# EasyEDA Pro project ProPrj_桌面数控电源New_2025-02-12.epro, board PCB1
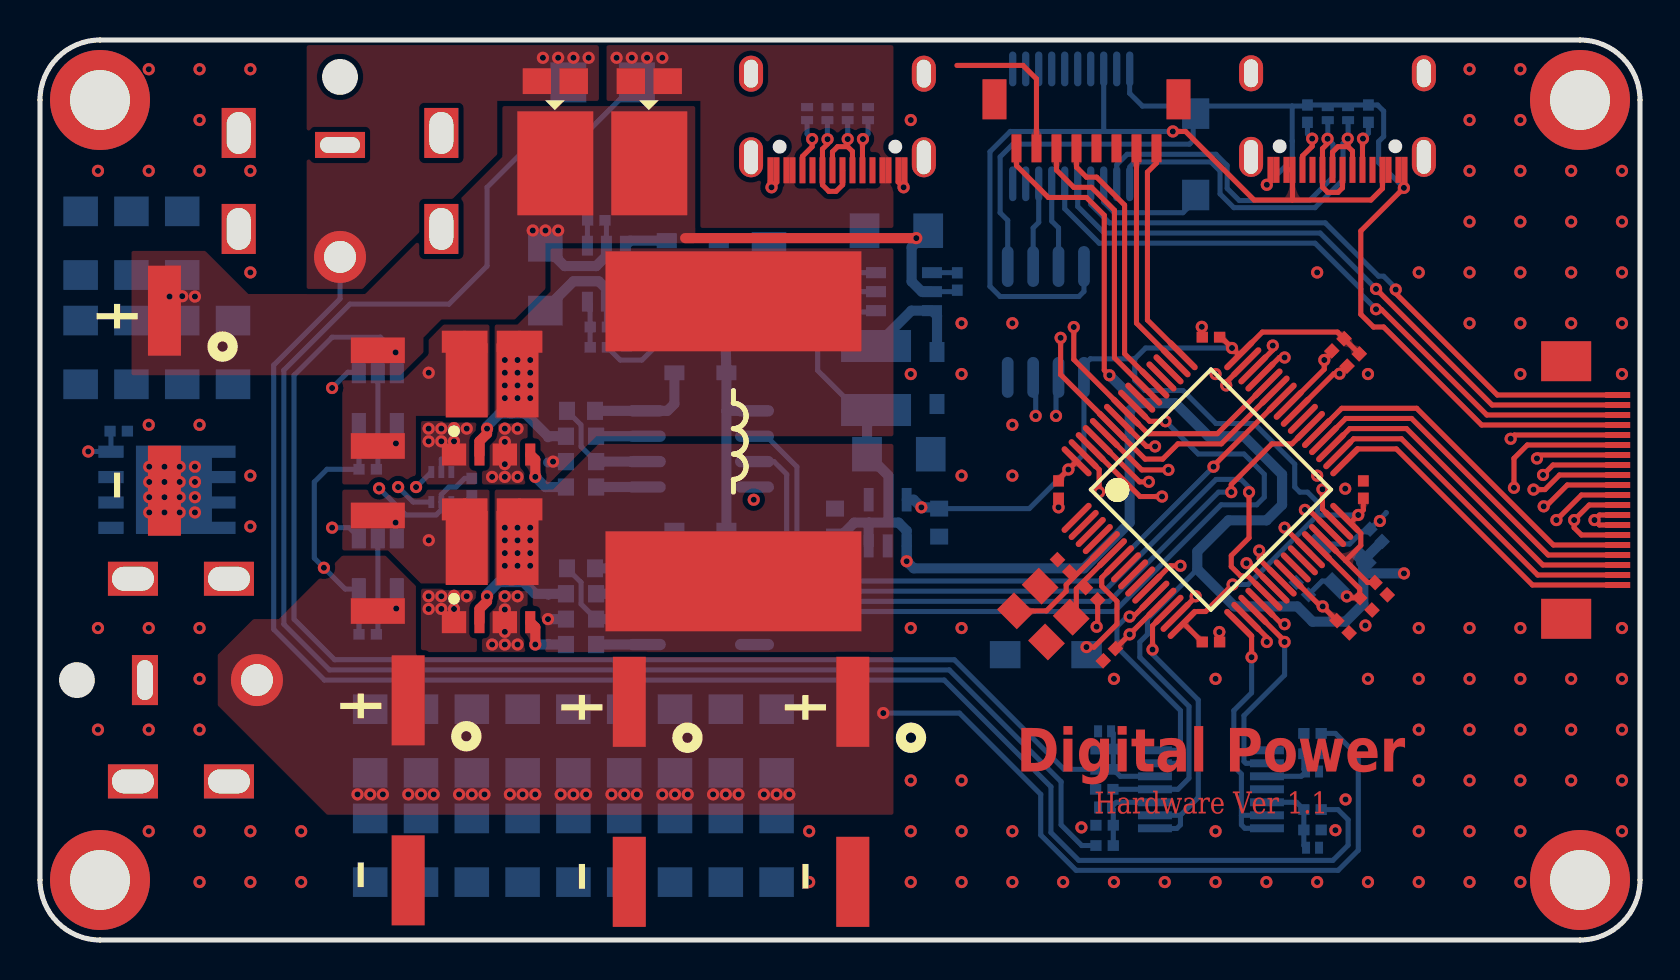
[diagram p2: board, top side]
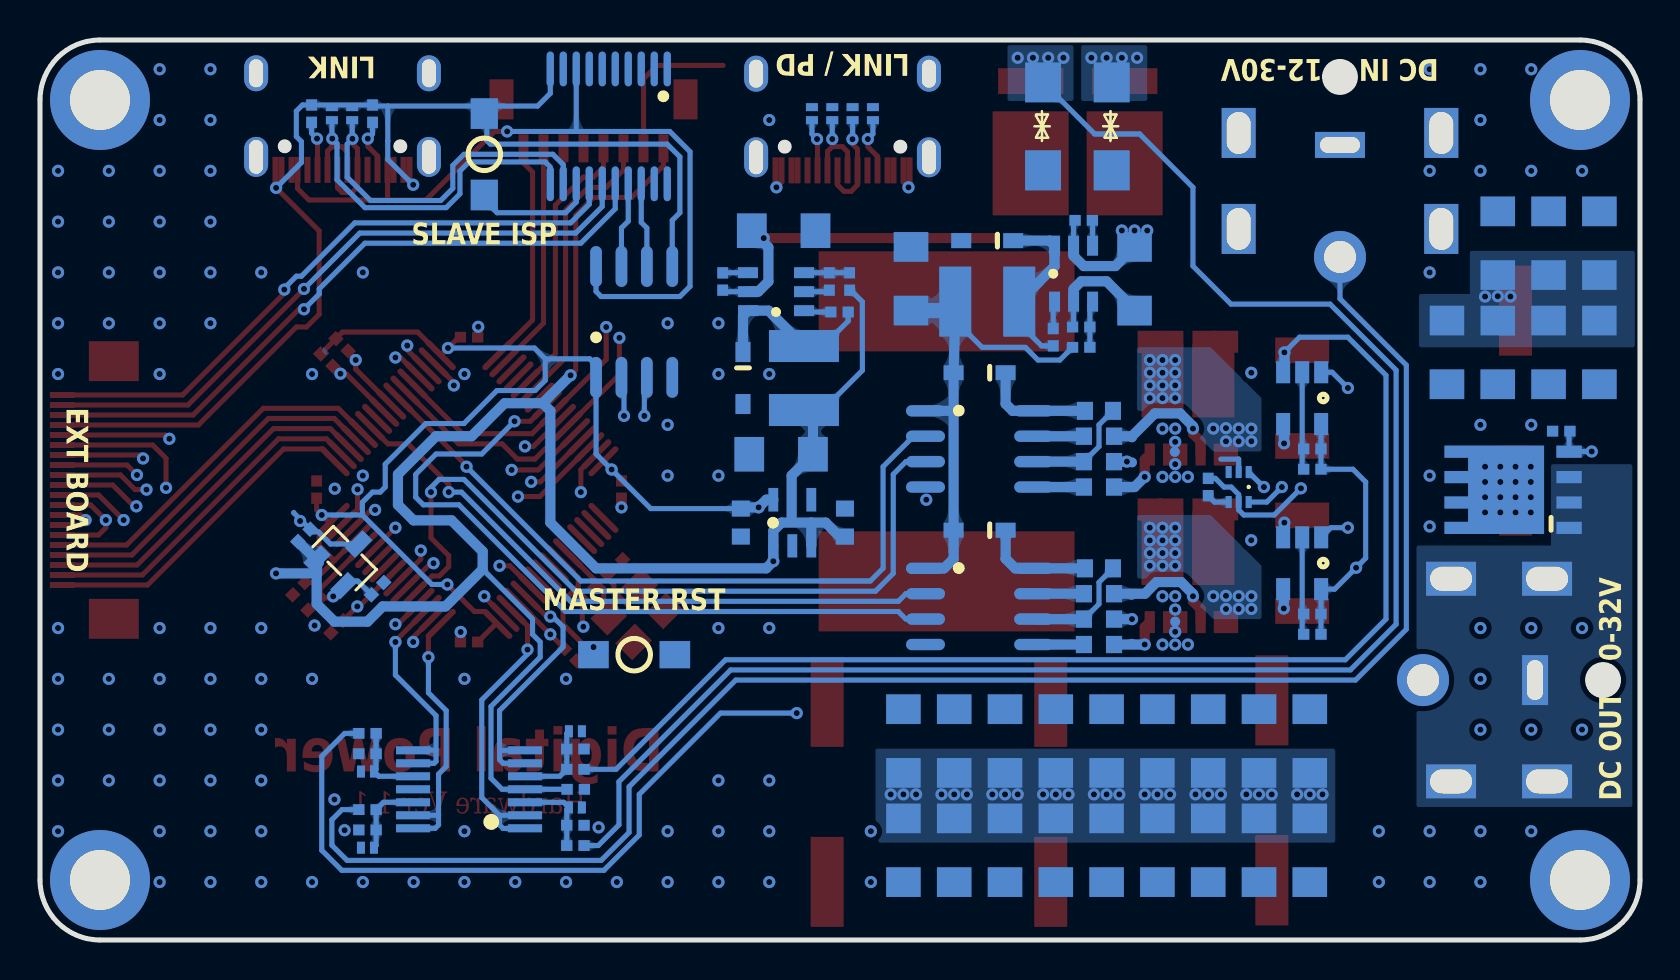
[diagram p3: board, bottom side, seen from below]

Outline 80 x 45 mm; copper layers: Top Layer, Inner1, Inner2, Bottom Layer. Coordinates in mm from the lower left corner of the outline.
Outline path: 0,42 0,3 arc(0.88,0.88) 3,0 77,0 arc(79.12,0.88) 80,3 80,42 arc(79.12,44.12) 77,45 3,45 arc(0.88,44.12) 0,42
Stack: Top Layer 0.035mm 外层铜厚1oz / Dielectric1 0.2104mm 7628 RC49% 8.6mil / Inner1 0.0152mm 内层铜厚 / Dielectric2 1.065mm 1.1mm H/HOZ Copper / Inner2 0.0152mm 内层铜厚 / Dielectric3 0.2104mm 7628 RC49% 8.6mil / Bottom Layer 0.035mm 外层铜厚1oz

## Design rules (mm)
template: 自定义配置
spacing copperThickness1oz (default): track to track 0.102, other pairs 0.152 to 0.3
spacing copperThickness2oz: track to track 0.203, other pairs 0.152 to 0.3
track width copperThickness1oz (default): min 0.127, default 0.254, max 2.54
track width copperThickness2oz: min 0.203, default 0.254, max 2.54
differential pair differentialPair (default): width min 0.127, default 0.254, max 2.54; gap min 0.152, default 0.152
via viaSize (default): diameter min 0.5, default 0.61, max 10; hole min 0.3, default 0.305, max 6.3
net VOUT uses Power
net VIN uses Power
net P_PD_IN uses Power
net P_DC_IN uses Power
net $1N8063 uses Power
net $1N8062 uses Power
net $1N8076 uses Power
net $1N8059 uses Power
net $1N11837 uses Power
pour e730 uses Power
pour e764 uses Power

## Placement (name value [footprint] x y rotation side)
C14  1uF  [C0603]  27.05 26.46 180 bottom
C15  1uF  [C0603]  27.05 18.58 180 bottom
C28  22uF  [C0603]  39.75 20.87 270 bottom
C29  22uF  [C0603]  44.96 20.87 90 bottom
C33  330uF  [CAP-SMD_BD10.0-L10.3-W10.3-FD]  18.41 7.48 270 top
C34  330uF  [CAP-SMD_BD10.0-L10.3-W10.3-FD]  29.46 7.41 270 top
C37  330uF  [CAP-SMD_BD10.0-L10.3-W10.3-FD]  6.22 26.97 270 top
C38  330uF  [CAP-SMD_BD10.0-L10.3-W10.3-FD]  40.64 7.41 270 top
C43  15pF  [C0402]  52.58 17.31 135 top
C44  15pF  [C0402]  51.18 18.71 315 top
C55  10uF  [C1206]  2.03 29.38 90 bottom
C56  10uF  [C1206]  4.57 29.38 90 bottom
C57  10uF  [C1206]  7.11 29.38 90 bottom
C58  10uF  [C1206]  9.65 29.38 90 bottom
C59  10uF  [C1206]  2.03 34.84 270 bottom
C60  10uF  [C1206]  7.11 34.84 270 bottom
C61  10uF  [C1206]  4.57 34.84 270 bottom
C66  10uF  [C1206]  16.51 4.49 90 bottom
C67  10uF  [C1206]  19.05 4.49 90 bottom
C68  10uF  [C1206]  21.59 4.49 90 bottom
C69  10uF  [C1206]  24.13 4.49 90 bottom
C70  10uF  [C1206]  26.67 4.49 90 bottom
C71  10uF  [C1206]  29.21 4.49 90 bottom
C72  10uF  [C1206]  31.75 9.95 270 bottom
C73  10uF  [C1206]  29.21 9.95 270 bottom
C74  10uF  [C1206]  26.67 9.95 270 bottom
C75  10uF  [C1206]  24.13 9.95 270 bottom
C76  10uF  [C1206]  21.59 9.95 270 bottom
C77  10uF  [C1206]  19.05 9.95 270 bottom
C78  10uF  [C1206]  16.51 9.95 270 bottom
C79  100nF  [C0402]  29.34 30.14 90 bottom
C80  10uF  [C1206]  36.45 33.06 270 bottom
C81  10uF  [C1206]  25.27 33.06 90 bottom
C82  100nF  [C0402]  40.02 31.4 0 bottom
C83  10uF  [C1206]  42.95 24.29 180 bottom
C84  10uF  [C1206]  42.82 35.46 0 bottom
C85  100nF  [C0402]  16.38 16.3 180 bottom
C86  1uF  [C0402]  16.38 15.28 180 bottom
C87  100nF  [C0402]  16.38 24.55 180 bottom
C88  1uF  [C0402]  16.38 23.54 180 bottom
C89  100nF  [C0402]  21.59 22.65 90 bottom
C90  100nF  [C0402]  58.55 30.14 0 top
C91  100nF  [C0402]  67.06 17.57 135 top
C92  100nF  [C0402]  58.55 14.9 180 top
C93  100nF  [C0402]  66.17 22.52 270 top
C94  100nF  [C0402]  66.8 20.23 135 bottom
C95  100nF  [C0402]  63.12 17.57 135 bottom
C96  100nF  [C0402]  50.93 22.52 270 top
C97  100nF  [C0402]  66.29 16.81 315 top
C98  10uF  [C1206]  31.75 4.49 90 bottom
C99  10uF  [C1206]  36.83 9.95 270 bottom
C100  10uF  [C1206]  36.83 4.49 90 bottom
C101  10uF  [C1206]  34.29 9.95 270 bottom
C102  10uF  [C1206]  34.29 4.49 90 bottom
C103  100nF  [C0402]  53.21 7.53 180 bottom
D5  1N5819WS  [SOD-323_L1.6-W1.3-LS2.6-RD-1]  33.02 28.36 0 bottom
D6  1N5819WS  [SOD-323_L1.6-W1.3-LS2.6-RD-1]  33.02 20.49 0 bottom
D21  PESD5V0G1BLYL  [DFN1006-2L-BI-1]  38.35 41.32 270 bottom
D22  PESD5V0G1BLYL  [DFN1006-2L-BI-1]  41.4 41.32 270 bottom
D23  PESD5V0G1BLYL  [DFN1006-2L-BI-1]  39.37 41.32 270 bottom
D24  PESD5V0G1BLYL  [DFN1006-2L-BI-1]  40.39 41.32 270 bottom
D25  SB10100  [TO-277_3P-L5.4-W4.0-LS6.5-TR]  25.76 40.89 90 top
D26  SB10100  [TO-277_3P-L5.4-W4.0-LS6.5-TR]  30.46 40.89 90 top
D27  PESD5V0G1BLYL  [DFN1006-2L-BI-1]  65.41 41.32 270 bottom
D28  PESD5V0G1BLYL  [DFN1006-2L-BI-1]  64.39 41.32 270 bottom
D31  1N5819WS  [SOD-323_L1.6-W1.3-LS2.6-RD-1]  32.64 34.97 0 bottom
D32  1N5819WS  [SOD-323_L1.6-W1.3-LS2.6-RD-1]  44.85 28.1 270 bottom
D33  SMAJ36CA  [SMA_L4.4-W2.8-LS5.1-BI]  26.42 40.68 270 bottom
D34  SMAJ36CA  [SMA_L4.4-W2.8-LS5.1-BI]  29.84 40.68 270 bottom
D35  PESD5V0G1BLYL  [DFN1006-2L-BI-1]  53.23 10.44 0 bottom
D36  PESD5V0G1BLYL  [DFN1006-2L-BI-1]  63.63 8.42 180 bottom
D37  PESD5V0G1BLYL  [DFN1006-2L-BI-1]  53.23 6.63 0 bottom
D38  PESD5V0G1BLYL  [DFN1006-2L-BI-1]  63.63 4.61 180 bottom
DC1  KH-DC-007B-2.5G  [DC-IN-TH_KH-DC-007B-2.1G]  15 37.25 0 top
DC2  KH-DC-007B-2.5G  [DC-IN-TH_KH-DC-007B-2.1G]  7.75 13 90 top
FPC1  FPC-05F-20PH20  [FPC-SMD_20P-P0.50_XUNPU_FPC-05F-20PH20]  77.6 22.5 270 top
L1  22uH  [IND-SMD_L18.3-W17.0]  34.67 24.93 270 top
L2  6.8uH  [IND-SMD_L4.0-W4.0]  32.64 31.92 0 bottom
L3  6.8uH  [IND-SMD_L4.0-W4.0]  41.8 28.1 270 bottom
LDO1  ME6211C33M5G-N  [SOT-23-5_L3.0-W1.7-P0.95-LS2.8-BL]  42.38 20.86 180 bottom
NOREF  -  [Pad_e127]  3 42 0 top
NOREF#2  -  [Pad_e128]  3 3 0 top
NOREF#3  -  [Pad_e130]  77 3 0 top
NOREF#4  -  [Pad_e129]  77 42 0 top
Q2  FDMS86101A  [POWER56_L5.0-W6.0-P1.27-LS6.6-BL]  6.35 22.52 90 bottom
R17  20  [R0603]  27.05 25.19 180 bottom
R18  20  [R0603]  27.05 22.65 180 bottom
R19  20  [R0603]  27.05 17.31 0 bottom
R20  20  [R0603]  27.05 14.77 0 bottom
R21  5  [R0603]  27.05 16.04 0 bottom
R22  5  [R0603]  27.05 23.92 180 bottom
R54  10K  [R0402]  53.23 8.53 180 bottom
R55  10K  [R0402]  63.63 10.33 0 bottom
R56  10K  [R0402]  53.23 4.72 180 bottom
R57  10K  [R0402]  63.63 6.52 0 bottom
R65  1K  [R0402]  53.23 9.55 0 bottom
R66  1K  [R0402]  63.63 9.31 180 bottom
R67  1K  [R0402]  53.23 5.74 0 bottom
R68  1K  [R0402]  63.63 5.5 180 bottom
R71  10mR  [R2010]  16.89 27.09 270 top
R72  10mR  [R2010]  16.89 18.84 270 top
R73  10K  [R0402]  63.37 41.32 270 bottom
R74  10K  [R0402]  66.42 41.32 270 bottom
R75  14K  [R0402]  27.94 29.63 0 bottom
R76  1K  [R0402]  27.94 30.65 180 bottom
R77  10K  [R0402]  27.81 35.98 0 bottom
R78  5.1K  [R0402]  39.52 32.92 270 bottom
R79  1K  [R0402]  40.53 32.92 90 bottom
R80  10K  [R0402]  45.87 32.92 270 bottom
R81  ???  [R0402]  53.47 14.27 45 top
R82  ???  [R0402]  65.15 15.66 135 top
R83  1K  [R0402]  64.9 29.76 45 top
R84  1K  [R0402]  65.66 29 45 top
R85  1M  [R0402]  3.94 25.44 180 bottom
SW5  -  [Key_SMD_3x4x2]  50.29 14.27 180 bottom
SW6  -  [Key_SMD_3x4x2]  57.78 39.28 90 bottom
TP7  -  [Test-Point-0.5mm]  25.42 14.81 180 bottom
TP8  -  [Test-Point-0.5mm]  25.42 17.26 180 bottom
TP9  -  [Test-Point-0.5mm]  25.4 25.13 180 bottom
TP10  -  [Test-Point-0.5mm]  25.4 22.65 180 bottom
TP11  -  [Test-Point-0.5mm]  19.43 28.36 180 bottom
TP12  -  [Test-Point-0.5mm]  23.24 15.92 180 bottom
TP13  -  [Test-Point-0.5mm]  25.4 23.88 180 bottom
TP14  -  [Test-Point-0.5mm]  25.42 16 180 bottom
TP15  -  [Test-Point-0.5mm]  23.26 24.41 180 bottom
TP16  -  [Test-Point-0.5mm]  19.45 19.99 180 bottom
U1  STM32G431RBT6  [LQFP-64_L10.0-W10.0-P0.50-LS12.0-BL]  58.55 22.52 315 top
U9  IRS21867STRPBF  [SOIC-8_L5.0-W4.0-P1.27-LS6.0-BL]  33.02 24.55 270 bottom
U10  IRS21867STRPBF  [SOIC-8_L5.0-W4.0-P1.27-LS6.0-BL]  33.02 16.68 270 bottom
U48  AP50H06NF  [DFN-8_L6.0-W5.0-P1.27-LS6.2-BL_STL50DN6F7]  22.61 27.09 0 top
U49  AP50H06NF  [DFN-8_L6.0-W5.0-P1.27-LS6.2-BL_STL50DN6F7]  22.61 18.71 0 top
U50  WAFER-SH1.0-8PLB  [CONN-SMD_8P-P1.00_XUNPU_WAFER-SH1.0-8PLB]  52.32 40.81 180 top
U52  π122U31  [SOIC-8_L4.9-W3.9-P1.27-LS6.0-BL]  50.29 30.9 180 bottom
U53  STC8H8K64U-45I-TSSOP20  [TSSOP-20_L6.5-W4.4-P0.65-LS6.5-BL]  51.56 40.68 0 bottom
U56  INA139NA/250  [TSOT-23-5_L2.9-W1.6-P0.95-LS2.8-BR]  16.89 27.09 90 bottom
U57  INA139NA/250  [TSOT-23-5_L2.9-W1.6-P0.95-LS2.8-BR]  16.89 18.84 90 bottom
U58  -  [SOT-23-6_L2.9-W1.6-P0.95-LS2.8-BR]  28.32 33.32 270 bottom
U59  -  [SOT-23-6_L2.9-W1.6-P0.95-LS2.8-BR]  43.2 32.42 180 bottom
U60  TMP102AIDRLR  [SOT-563_L1.6-W1.2-P0.50-LS1.6-BR]  20.07 22.65 90 bottom
U61  REF3033AIDBZRQ1  [SOT-23-3_L2.9-W1.3-P1.90-LS2.4-BR]  64.77 19.09 315 bottom
U62  LMV324IPWR  [TSSOP-14_L5.0-W4.4-P0.65-LS6.4-BL]  58.55 7.53 90 bottom
USB5  -  [USB_TYPE-C-16P]  65 40.92 180 top
USB6  -  [USB_TYPE-C-16P]  40 40.9 180 top
X1  24MHz  [OSC-SMD_4P-L3.2-W2.5-BL]  50.16 16.3 135 top

## Footprints (pads in the part's own frame, mm; a bottom-side part is the same pattern mirrored in y, then rotated)
C0402
  rect 0.566x0.54 smd: 1(-0.433,0) 2(0.433,0)
C0603
  rect 0.8x0.9 smd: 1(-0.7,0) 2(0.7,0)
C1206
  rect 1.485x1.728 smd: 1(-1.593,0) 2(1.593,0)
CAP-SMD_BD10.0-L10.3-W10.3-FD
  rect 4.5x1.65 smd: 1(-4.5,0) 2(4.5,0)
CONN-SMD_8P-P1.00_XUNPU_WAFER-SH1.0-8PLB
  rect 0.5x1.4 smd: 1(-3.5,1.225) 2(-2.5,1.225) 3(-1.5,1.225) 4(-0.5,1.225) 5(0.5,1.225) 6(1.5,1.225) 7(2.5,1.225) 8(3.5,1.225)
  rect 1.2x2 smd: 9(4.6,-1.225) 10(-4.6,-1.225)
DC-IN-TH_KH-DC-007B-2.1G
  rect 1.7x2.5 hole 1.2x2.1: 2(-5.065,3.1) 2(-5.065,-1.7) 2(5.065,3.1) 2(5.065,-1.7)
  rect 2.5x1.3 hole 2x0.8: 3(0,2.5)
  round 2.6 hole 1.6: 4(0,-3.1)
DFN1006-2L-BI-1
  rect 0.4x0.6 smd: 1(-0.325,0) 2(0.325,0)
DFN-8_L6.0-W5.0-P1.27-LS6.2-BL_STL50DN6F7
  rect 1.219x1.1 smd: 1(-1.905,-2.82) 3(0.635,-2.82) 5(1.905,2.82) 6(0.838,2.82) 7(-0.838,2.82) 8(-1.905,2.82)
  rect 0.508x1.1 smd: 2(-0.635,-2.82) 4(1.905,-2.82)
  rect 2.1x3.7 smd: 6(1.27,0.889) 8(-1.27,0.889)
FPC-SMD_20P-P0.50_XUNPU_FPC-05F-20PH20
  rect 0.3x1.25 smd: 1(-4.75,1.288) 2(-4.25,1.288) 3(-3.75,1.288) 4(-3.25,1.288) 5(-2.75,1.288) 6(-2.25,1.288) 7(-1.75,1.288) 8(-1.25,1.288) 9(-0.75,1.288) 10(-0.25,1.288) 11(0.25,1.288) 12(0.75,1.288) 13(1.25,1.288) 14(1.75,1.288) 15(2.25,1.288) 16(2.75,1.288) 17(3.25,1.288) 18(3.75,1.288) 19(4.25,1.288) 20(4.75,1.288)
  rect 2x2.5 smd: 21(6.44,-1.288) 22(-6.44,-1.288)
IND-SMD_L4.0-W4.0
  rect 1.6x3.5 smd: 1(-1.6,0) 2(1.6,0)
IND-SMD_L18.3-W17.0
  rect 5x12.8 smd: 1(-7,0) 2(7,0)
Key_SMD_3x4x2
  rect 1.53x1.36 smd: 1(-2.035,0) 2(2.035,0)
LQFP-64_L10.0-W10.0-P0.50-LS12.0-BL
  oval 0.3x2 smd: 1(-3.75,-5.75) 2(-3.25,-5.75) 3(-2.75,-5.75) 4(-2.25,-5.75) 5(-1.75,-5.75) 6(-1.25,-5.75) 7(-0.75,-5.75) 8(-0.25,-5.75) 9(0.25,-5.75) 10(0.75,-5.75) 11(1.25,-5.75) 12(1.75,-5.75) 13(2.25,-5.75) 14(2.75,-5.75) 15(3.25,-5.75) 16(3.75,-5.75) 33(3.75,5.75) 34(3.25,5.75) 35(2.75,5.75) 36(2.25,5.75) 37(1.75,5.75) 38(1.25,5.75) 39(0.75,5.75) 40(0.25,5.75) 41(-0.25,5.75) 42(-0.75,5.75) 43(-1.25,5.75) 44(-1.75,5.75) 45(-2.25,5.75) 46(-2.75,5.75) 47(-3.25,5.75) 48(-3.75,5.75)
  oval 2x0.3 smd: 17(5.75,-3.75) 18(5.75,-3.25) 19(5.75,-2.75) 20(5.75,-2.25) 21(5.75,-1.75) 22(5.75,-1.25) 23(5.75,-0.75) 24(5.75,-0.25) 25(5.75,0.25) 26(5.75,0.75) 27(5.75,1.25) 28(5.75,1.75) 29(5.75,2.25) 30(5.75,2.75) 31(5.75,3.25) 32(5.75,3.75) 49(-5.75,3.75) 50(-5.75,3.25) 51(-5.75,2.75) 52(-5.75,2.25) 53(-5.75,1.75) 54(-5.75,1.25) 55(-5.75,0.75) 56(-5.75,0.25) 57(-5.75,-0.25) 58(-5.75,-0.75) 59(-5.75,-1.25) 60(-5.75,-1.75) 61(-5.75,-2.25) 62(-5.75,-2.75) 63(-5.75,-3.25) 64(-5.75,-3.75)
OSC-SMD_4P-L3.2-W2.5-BL
  rect 1.4x1.2 smd: 1(-1.1,-0.875) 2(1.1,-0.875) 3(1.1,0.875) 4(-1.1,0.875)
Pad_e127
  round 5 hole 3: 1(0,0)
Pad_e128
  round 5 hole 3: 1(0,0)
Pad_e129
  round 5 hole 3: 1(0,0)
Pad_e130
  round 5 hole 3: 1(0,0)
POWER56_L5.0-W6.0-P1.27-LS6.6-BL
  rect 0.61x1.27 smd: 1(1.895,-2.804) 3(-1.915,-2.804) 3(-0.645,-2.804) 3(0.625,-2.804)
  custom 4.42x4.985 smd: 2(-0.01,0.939)
R0402
  rect 0.566x0.54 smd: 1(-0.433,0) 2(0.433,0)
R0603
  rect 0.806x0.864 smd: 1(-0.753,0) 2(0.753,0)
R2010
  rect 1.282x2.7 smd: 1(-2.391,0) 2(2.391,0)
SMA_L4.4-W2.8-LS5.1-BI
  rect 2x1.8 smd: 1(-2.2,0) 2(2.2,0)
SOD-323_L1.6-W1.3-LS2.6-RD-1
  rect 1x0.75 smd: 1(-1.3,0) 2(1.3,0)
SOIC-8_L4.9-W3.9-P1.27-LS6.0-BL
  oval 0.588x2.045 smd: 1(-1.905,-2.772) 2(-0.635,-2.772) 3(0.635,-2.772) 4(1.905,-2.772) 5(1.905,2.772) 6(0.635,2.772) 7(-0.635,2.772) 8(-1.905,2.772)
SOIC-8_L5.0-W4.0-P1.27-LS6.0-BL
  oval 0.569x1.95 smd: 1(-1.905,-2.705) 2(-0.635,-2.705) 3(0.635,-2.705) 4(1.905,-2.705) 5(1.905,2.705) 6(0.635,2.705) 7(-0.635,2.705) 8(-1.905,2.705)
SOT-23-3_L2.9-W1.3-P1.90-LS2.4-BR
  rect 1.25x0.7 smd: 1(1,-0.95) 2(1,0.95) 3(-1,0)
SOT-23-5_L3.0-W1.7-P0.95-LS2.8-BL
  rect 0.49x1.157 smd: 1(-0.95,-1.153) 2(0,-1.153) 3(0.95,-1.153)
  rect 0.49x1.175 smd: 4(0.95,1.153) 5(-0.95,1.153)
SOT-23-6_L2.9-W1.6-P0.95-LS2.8-BR
  rect 1x0.55 smd: 1(1.4,-0.95) 2(1.4,0) 3(1.4,0.95) 4(-1.4,0.95) 5(-1.4,0) 6(-1.4,-0.95)
SOT-563_L1.6-W1.2-P0.50-LS1.6-BR
  rect 0.6x0.3 smd: 1(0.75,-0.5) 2(0.75,0) 3(0.75,0.5) 4(-0.75,0.5) 5(-0.75,0) 6(-0.75,-0.5)
Test-Point-0.5mm
  round 0.5 smd: 1(0,0)
TO-277_3P-L5.4-W4.0-LS6.5-TR
  rect 1.29x1.423 smd: 1(2.054,0.92) 3(2.054,-0.92)
  rect 5.2x3.8 smd: 2(-2.054,0)
TSOT-23-5_L2.9-W1.6-P0.95-LS2.8-BR
  rect 1.1x0.7 smd: 1(1.294,-0.951) 2(1.294,-0.001) 3(1.294,0.951) 4(-1.294,0.951) 5(-1.294,-0.949)
TSSOP-14_L5.0-W4.4-P0.65-LS6.4-BL
  rect 0.4x1.7 smd: 1(-1.95,-2.8) 2(-1.3,-2.8) 3(-0.65,-2.8) 4(0,-2.8) 5(0.65,-2.8) 6(1.3,-2.8) 7(1.95,-2.8) 8(1.95,2.8) 9(1.3,2.8) 10(0.65,2.8) 11(0,2.8) 12(-0.65,2.8) 13(-1.3,2.8) 14(-1.95,2.8)
TSSOP-20_L6.5-W4.4-P0.65-LS6.5-BL
  oval 0.364x1.742 smd: 1(-2.925,-2.871) 2(-2.275,-2.871) 3(-1.625,-2.871) 4(-0.975,-2.871) 5(-0.325,-2.871) 6(0.325,-2.871) 7(0.975,-2.871) 8(1.625,-2.871) 9(2.275,-2.871) 10(2.925,-2.871) 11(2.925,2.871) 12(2.275,2.871) 13(1.625,2.871) 14(0.975,2.871) 15(0.325,2.871) 16(-0.325,2.871) 17(-0.975,2.871) 18(-1.625,2.871) 19(-2.275,2.871) 20(-2.925,2.871)
USB_TYPE-C-16P
  oval 1.2x2 hole 0.7x1.7: 1(-4.193,1.765) 2(4.447,1.765)
  oval 1.2x1.8 hole 0.7x1.4: 3(-4.193,-2.415) 4(4.447,-2.415)
  rect 0.3x1.3 smd: A1(-3.223,2.415) A4(-2.423,2.415) A5(-1.123,2.415) A6(-0.123,2.415) A7(0.377,2.415) A8(1.377,2.415) A9(2.677,2.415) A12(3.477,2.415) B1(3.177,2.415) B4(2.377,2.415) B5(1.877,2.415) B6(0.877,2.415) B7(-0.623,2.415) B8(-1.623,2.415) B9(-2.123,2.415) B12(-2.923,2.415)

## Nets
As in the schematic, except:
GND: C28.1 C29.1 C33.2 C34.2 C37.2 C38.2 C43.1 C44.1 C55.1 C56.1 C57.1 C58.1 C59.1 C60.1 C61.1 C66.1 C67.1 C68.1 C69.1 C70.1 C71.1 C72.1 C73.1 C74.1 C75.1 C76.1 C77.1 C78.1 C80.1 C81.1 C83.1 C84.1 C85.1 C86.1 C87.1 C88.1 C89.1 C90.1 C91.1 C92.1 C93.1 C94.2 C95.2 C96.2 C97.2 C98.1 C99.1 C100.1 C101.1 C102.1 C103.2 D21.1 D22.1 D23.1 D24.1 D31.2 D32.2 D33.2 D34.2 D35.1 D36.1 D37.1 D38.1 DC1.2 DC1.3 FPC1.12 FPC1.15 FPC1.21 FPC1.22 LDO1.2 NOREF.1 NOREF#2.1 NOREF#3.1 NOREF#4.1 Q2.2 R65.1 R66.1 R67.1 R68.1 R76.1 R79.1 R81.1 R82.1 R85.1 SW5.2 TP12.1 TP15.1 U1.15 U1.27 U1.31 U1.47 U1.63 U9.4 U10.4 U48.3 U49.3 U50.7 U52.4 U56.2 U57.2 U58.2 U59.2 U60.2 U60.4 U61.3 U62.11 USB6.A1 USB6.A12 USB6.B1 USB6.B12 X1.2 X1.4

Pads without a net: LDO1 4; U1 1 2 3 4 8 9 10 25 26 39 52 55; U50 3 4 9 10; U53 1 2 3 4 5 6 7 9 19 20; U60 3; USB5 1 2 3 4 A8 B8; USB6 1 2 3 4 A8 B8

## Via types
v1: diameter 0.61, hole 0.305, Top Layer to Bottom Layer, 320 vias

## Routing (per net, layer and track width the routed paths; a pad name or vN(x,y) marks a point on that pad's centre or on a via; arc(x,y) is an arc through that point)
+3.3V: length 101.1
  Top Layer w0.254: C96.1 50.93,23.03 v1(51.42,23.52) U1.64 ; 57.55,16.22 U1.16 57.21,15.8 C92.2 ; C93.2 66.17,21.5 v1(65.91,21.25) 65.52,20.85 ; 65.97,29.3 R83.2 64.87,30.39 61.12,30.39 59.96,29.24 v1(59.6,29.6) 59.06,30.14 C90.2 ; 65.52,20.85 65.26,21.11 ; 65.52,20.85 66.04,20.33 66.04,19.73 65.28,18.97 ; 57.86,16.42 58.28,16.42 v1(59.63,17.78) ; 65.28,18.97 U1.29 ; 65.28,18.97 66.38,17.87 C91.2
  Inner2 w0.254: v1(44.07,21.63) 42.67,23.03 28.96,23.03 27.31,21.38 19.05,21.38 18.41,22.01 17.53,22.01 v1(16.95,22.58)
  Bottom Layer w0.254: 63.88,21.25 63.88,21.89 63.37,22.39 62.99,22.39 62.74,22.65 62.74,23.79 60.71,25.82 58.8,25.82 57.15,27.47 55.25,27.47 54.74,27.98 54.74,29.06 ; 63.88,21.25 v1(65.91,21.25) ; 63.88,21.25 60.41,17.78 v1(59.63,17.78) ; C29.2 49.46,21.57 v1(51.42,23.52) 52.2,24.3 52.2,28.74 52.51,29.06 54.74,29.06 ; 54.74,29.06 55.28,29.6 v1(59.6,29.6) ; v1(16.95,22.58) 18.29,21.25 19.81,21.25 20.07,21.5 U60.5 20.07,22.27 20.44,22.65 20.8,22.65 21.23,23.08 C89.2
  Bottom Layer w0.508: LDO1.5 43.69,22.02 v1(44.07,21.63) 44.9,21.63 C29.2
+3.3V-REF: length 5.9
  Top Layer w0.254: v1(65.34,17.18) 65.41,17.11 C97.1 65.99,17.56 U1.28
  Bottom Layer w0.254: 63.43,17.26 64.11,17.95 64.57,17.95 64.81,17.71
+5V: length 167.6
  Top Layer w0.254: U50.8 48.82,38.72 50.42,37.13 52.32,37.13 53.21,36.24 53.21,28.49 53.47,28.24 ; FPC1.14 77.97,20.75 v1(77.72,21) 77.98,21.25 FPC1.13
  Inner2 w0.254: v1(43.33,18.94) 37.52,13.12 15.75,13.12 14.2,14.68 v1(14.2,18.61)
  Inner2 w0.508: v1(68.2,18.33) 73.79,18.33 75.69,20.23 77.09,20.23 77.72,20.87 v1(77.72,21)
  Bottom Layer w0.254: L3.2 40.86,26.5 38.88,28.48 38.88,31.91 39.47,32.49 R78.2 ; C86.2 C85.2 15.95,17.54 U57.5 15.26,17.54 v1(14.2,18.61) 13.72,19.09 13.72,22.9 14.35,23.54 C88.2 C87.2 15.95,25.79 U56.5 ; C103.1 U62.4 56.9,7.53 57.45,8.09 57.45,11.68 54.99,14.14 54.99,14.9 55.37,15.28 55.37,16.04 57.87,18.54
  Bottom Layer w0.508: L3.2 41.35,26.05 C83.2 42.42,23.22 42.42,21 ; 66.17,18.33 66.15,18.33 66.15,18.78 ; 66.17,18.33 66.17,16.81 65.28,15.92 63.63,15.92 62.87,16.68 59.72,16.68 57.87,18.54 57.87,19.43 59.42,20.98 61.33,20.98 62.1,21.76 62.1,23.28 60.2,25.19 58.42,25.19 56.77,26.84 54.87,26.84 ; 66.17,18.33 v1(68.2,18.33) ; 66.17,18.33 66.17,18.76 66.15,18.78 ; 54.87,26.84 v1(53.47,28.24) ; 54.87,26.84 54.86,26.84 54.48,26.46 54.48,20.87 52.2,18.58 43.69,18.58 v1(43.33,18.94) LDO1.1 43.33,20.46 42.93,20.87 41.43,20.87 ; 66.15,18.78 66.15,18.87 ; 41.43,20.87 40.72,20.87 40.02,20.17 C28.2 ; 41.43,20.87 LDO1.3 ; 66.15,18.87 U61.1 ; 66.15,18.87 66.05,18.87 ; 66.19,19.01 C94.1
+12V: length 25.7
  Bottom Layer w0.254: R75.2 29.01,29 30.1,29 30.73,29.63 32.89,29.63 34.24,30.98
  Bottom Layer w0.508: L2.2 34.24,31.47 ; 34.24,31.47 D5.2 34.32,26.46 ; 34.24,31.47 34.24,30.98 ; 35.72,18.58 34.8,18.58 34.32,19.06 D6.2 34.32,26.46 ; 34.32,26.46 35.72,26.46
  Bottom Layer w0.762: C80.2 34.69,31.47 L2.2
D5V: length 40.3
  Top Layer w0.254: USB5.B9 67.12,37.58 66.55,37 62.62,37 ; 62.62,37 USB5.B4 USB5.A9 ; 62.62,37 60.71,37 57.28,40.43 v1(56.64,40.43)
  Bottom Layer w0.254: U53.8 53.19,40.43 53.19,40.43 ; 53.19,40.43 v1(56.64,40.43) ; 53.19,40.43 48.51,40.43 47.5,39.41 47.5,32.68 48.01,32.17 51.94,32.17 52.2,32.43 52.2,33.42
DGND: length 62.8
  Top Layer w0.254: FPC1.4 72.08,25.75 67.18,30.65 66.68,30.65 66.04,31.28 66.04,35.45 v1(68.2,37.61)
  Bottom Layer w0.254: U52.5 48.39,35.98 48.01,36.36 48.01,39.16 48.64,39.79 57.48,39.79 57.66,39.97 57.66,41.19 57.91,41.45 ; v1(61.34,37.76) 62.61,39.03 62.61,39.95 62.61,39.95 62.61,41.7 ; 62.61,41.7 55.12,41.7 54.48,42.33 54.48,43.55 U53.10 ; 62.61,41.7 63.32,41.7 R73.1 R74.1 66.88,41.75 67.18,41.44 67.18,40.17 66.93,39.92 66.93,38.87 v1(68.2,37.61)
GND: length 50.5
  Top Layer w0.254: U1.47 59.31,27.88 v1(59.31,27.73) ; v1(52.96,22.39) 52.96,23.51 U1.63 ; USB6.B12 42.92,37.89 v1(43.18,37.63) 43.22,37.68 USB6.A1 ; USB6.A12 36.52,37.69 v1(36.58,37.63) 36.82,37.88 USB6.B1 ; v1(57.78,17.19) 57.78,17.16 56.78,16.16 ; v1(64.12,22.53) 64.12,21.54 64.91,20.75 ; v1(52.83,15.66) 52.88,15.72 C43.1 ; 45.85,43.73 49.15,43.73 49.82,43.06 U50.7 ; FPC1.12 77.46,21.75 v1(76.71,21) 76.71,20.62 77.07,20.25 FPC1.15 ; U1.27 63.5,19.35 v1(62.23,20.62)
  Bottom Layer w0.254: U57.2 16.89,15.36 C86.1 ; 21.59,22.22 21.27,21.9 U60.4 ; R79.1 40.61,32.42 U59.2 ; U56.2 16.89,23.61 C88.1 ; 67.31,21.38 67.31,21.36 66.36,20.41 66.08,20.41 65.48,19.8 64.06,19.8 ; U60.2 20.07,24.05 20.96,24.05 ; U58.2 28.32,30.7 R76.1
  Bottom Layer w0.508: U58.2 28.32,32.55 27.94,32.94 26.67,32.94 25.27,31.54 C81.1
  vias: v1(2.9,38.46) v1(2.9,15.6) v1(2.9,10.52) v1(5.44,43.54) v1(5.44,38.46) v1(5.44,25.76) v1(5.44,15.6) v1(5.44,10.52) v1(5.44,5.44) v1(5.46,23.66) v1(5.46,22.9) v1(5.46,22.14) v1(5.46,21.38) v1(6.22,23.66) v1(6.22,22.9) v1(6.22,22.14) v1(6.22,21.38) v1(6.98,23.66) v1(6.98,22.9) v1(6.98,22.14) v1(6.98,21.38) v1(7.75,23.66) v1(7.75,22.9) v1(7.75,22.14) v1(7.75,21.38) v1(7.98,43.54) v1(7.98,41) v1(7.98,38.46) v1(7.98,25.76) v1(7.98,15.6) v1(7.98,13.06) v1(7.98,10.52) v1(7.98,5.44) v1(7.98,2.9) v1(10.52,43.54) v1(10.52,38.46) v1(10.52,33.38) v1(10.52,23.22) v1(10.52,20.68) v1(10.52,5.44) v1(10.52,2.9) v1(13.06,5.44) v1(13.06,2.9) v1(22.61,23.16) v1(22.61,14.77) v1(23.24,25.57) v1(23.24,24.91) v1(23.24,23.79) v1(23.24,23.16) v1(23.24,17.19) v1(23.24,16.52) v1(23.24,15.41) v1(23.24,14.77) v1(23.88,25.57) v1(23.88,23.16) v1(23.88,17.19) v1(23.88,14.77) v1(35.69,22.01) v1(38.46,5.44) v1(38.46,2.9) v1(43.54,41) v1(43.54,28.3) v1(43.54,15.6) v1(43.54,7.98) v1(43.54,5.44) v1(43.54,2.9) v1(46.08,30.84) v1(46.08,28.3) v1(46.08,23.22) v1(46.08,15.6) v1(46.08,7.98) v1(46.08,5.44) v1(46.08,2.9) v1(48.62,30.84) v1(48.62,25.76) v1(48.62,23.22) v1(48.62,5.44) v1(48.62,2.9) v1(50.93,21.63) v1(51.16,2.9) v1(52.07,5.63) v1(53.7,13.06) v1(53.7,2.9) v1(56.24,2.9) v1(58.09,30.66) v1(58.78,28.3) v1(58.78,13.06) v1(58.78,5.44) v1(58.78,2.9) v1(58.97,15.4) v1(61.32,2.9) v1(63.86,33.38) v1(63.86,23.22) v1(63.86,2.9) v1(64.77,5.49) v1(65.26,22.57) v1(65.28,7.03) v1(66.27,15.72) v1(66.4,28.3) v1(66.4,13.06) v1(66.4,2.9) v1(66.99,20.95) v1(68.94,33.38) v1(68.94,15.6) v1(68.94,13.06) v1(68.94,10.52) v1(68.94,7.98) v1(68.94,5.44) v1(68.94,2.9) v1(71.48,43.54) v1(71.48,41) v1(71.48,38.46) v1(71.48,35.92) v1(71.48,33.38) v1(71.48,30.84) v1(71.48,15.6) v1(71.48,13.06) v1(71.48,10.52) v1(71.48,7.98) v1(71.48,5.44) v1(71.48,2.9) v1(74.02,43.54) v1(74.02,41) v1(74.02,38.46) v1(74.02,35.92) v1(74.02,33.38) v1(74.02,30.84) v1(74.02,28.3) v1(74.02,15.6) v1(74.02,13.06) v1(74.02,10.52) v1(74.02,7.98) v1(74.02,5.44) v1(74.02,2.9) v1(76.56,38.46) v1(76.56,35.92) v1(76.56,33.38) v1(76.56,30.84) v1(76.56,13.06) v1(76.56,10.52) v1(76.56,7.98) v1(79.1,38.46) v1(79.1,35.92) v1(79.1,33.38) v1(79.1,30.84) v1(79.1,28.3) v1(79.1,15.6) v1(79.1,13.06) v1(79.1,10.52) v1(79.1,7.98) v1(79.1,5.44)
VIN: length 85
  Top Layer w0.508: 32.26,35.09 v1(43.81,35.09)
  Bottom Layer w0.254: U58.5 28.32,35.91 R77.2 ; 52.8,8.53 51.2,8.53 45.72,14.01 14.73,14.01 12.7,16.04 12.7,28.24 14.61,30.14 17.02,30.14 v1(17.78,29.38) ; R80.2 45.79,32.42 U59.5
  Bottom Layer w0.508: C81.2 26.23,33.7 27.81,33.7 28.32,34.2 U58.5 ; U59.5 44.09,32.42 43.58,32.92 43.58,34.63 C84.2 ; U56.3 17.78,28.45 v1(17.78,29.38)
  vias: v1(6.48,32.17) v1(7.11,32.19) v1(7.75,32.17) v1(24.64,35.47) v1(25.27,35.47) v1(25.91,35.47)
BEEP: length 26.5
  Top Layer w0.254: v1(73.53,25.06) 73.72,25.25 FPC1.5 ; v1(55.75,24.68) 55.33,24.68 53.95,26.06
  Inner2 w0.254: v1(73.53,25.06) 73.15,25.06 72.26,25.95 57.53,25.95 56.26,24.68 v1(55.75,24.68)
BOOST-HIGH-SIDE: length 31.8
  Top Layer w0.254: v1(59.56,22.39) 59.56,22.78 61.59,24.81 62.6,24.81 63.5,25.7
  Bottom Layer w0.254: 35.72,17.31 36.7,17.31 37.08,16.93 53.47,16.93 58.93,22.39 v1(59.56,22.39)
BOOST-LOW-SIDE: length 37.2
  Top Layer w0.254: v1(56.27,25.94) 55.48,25.94 U1.56
  Bottom Layer w0.254: v1(56.27,25.94) 57.91,24.3 60.2,24.3 61.21,23.28 61.21,22.14 60.83,21.76 59.06,21.76 53.72,16.42 37.08,16.42 36.7,16.04 35.72,16.04
BTN-1: length 30
  Top Layer w0.254: FPC1.9 75.98,23.25 75.25,22.52 v1(74.68,22.52) ; v1(56.1,22.17) 55.01,22.17 U1.62
  Inner2 w0.254: v1(74.68,22.52) 73.91,23.28 72.52,23.28 71.37,24.43 58.29,24.43 57.91,24.05 57.91,23.03 57.06,22.17 v1(56.1,22.17)
BTN-2: length 29.2
  Top Layer w0.254: v1(75.15,23.25) 75.65,23.75 FPC1.8 ; v1(55.44,22.91) 54.98,22.91 U1.61
  Inner2 w0.254: v1(75.15,23.25) 74.71,23.25 74.04,23.92 72.77,23.92 71.75,24.93 58.04,24.93 57.4,24.3 57.4,23.41 56.77,22.78 55.57,22.78 v1(55.44,22.91)
BTN-ENC: length 28.4
  Top Layer w0.254: v1(56.42,23.5) 55.09,23.5 53.24,25.35 ; v1(74.85,24.08) 74.85,24.22 74.88,24.25 FPC1.7
  Inner2 w0.254: v1(74.85,24.08) 74.45,24.48 73.1,24.48 72.14,25.44 57.78,25.44 56.9,24.55 56.9,23.76 56.64,23.5 v1(56.42,23.5)
BUCK-HIGH-SIDE: length 36.2
  Top Layer w0.254: v1(58.67,23.66) 58.67,23.71 62.08,27.12
  Bottom Layer w0.254: v1(58.67,23.66) 52.96,17.95 38.48,17.95 37.85,18.58 37.85,23.66 36.32,25.19 35.72,25.19
BUCK-LOW-SIDE: length 39.5
  Top Layer w0.254: v1(60.45,22.39) 60.45,20.11 59.56,19.22 59.56,18.67 60.03,18.2 60.39,18.2 U1.21
  Bottom Layer w0.254: 35.72,23.92 36.7,23.92 37.34,23.28 37.34,18.33 38.23,17.44 53.21,17.44 58.8,23.03 60.05,23.03 60.45,22.63 v1(60.45,22.39)
DEBUG-RX: length 14.5
  Top Layer w0.254: 55.37,27.47 53.72,29.11 53.72,36.49 52.58,37.63 51.69,37.63 50.82,38.5 U50.6
DEBUG-TX: length 13.7
  Top Layer w0.254: U50.5 51.82,38.64 52.32,38.14 52.83,38.14 54.23,36.75 54.23,29.31 55.72,27.82
ENCODER-CH1: length 21.4
  Top Layer w0.254: U1.20 62.1,15.79 v1(62.23,15.79) ; v1(75.82,21) 77.07,22.25 FPC1.11
  Inner2 w0.254: v1(62.23,15.79) 62.23,16.42 64.9,19.09 73.66,19.09 75.56,21 v1(75.82,21)
ENCODER-CH2: length 23.3
  Top Layer w0.254: v1(61.34,14.9) 61.34,15.13 60.31,16.16 ; FPC1.10 76.37,22.75 75.3,21.68 v1(75.18,21.68)
  Inner2 w0.254: v1(61.34,14.9) 61.34,16.3 64.64,19.6 73.1,19.6 v1(75.18,21.68)
I-IN-SAMPLE: length 62.1
  Top Layer w0.254: U1.13 56.05,16.85 56.05,16.85 v1(54.48,15.28) 53.77,14.57
  Inner2 w0.254: v1(14.61,27.6) 15.37,26.84 15.37,20.49 14.86,19.98 14.35,19.98 13.59,19.22 13.59,14.52 15.49,12.61 51.69,12.61 54.36,15.28 v1(54.48,15.28)
  Bottom Layer w0.254: v1(14.61,27.6) 15.39,28.39 U56.1
I-OUT-SAMPLE: length 67.6
  Top Layer w0.254: U1.24 64.04,16.68 v1(64.13,16.68) 64.84,15.97
  Inner2 w0.254: v1(14.61,20.62) 14.22,20.62 13.08,19.47 13.08,14.27 15.24,12.11 62.36,12.11 64.13,13.89 v1(64.13,16.68)
  Bottom Layer w0.254: v1(14.61,20.62) 15.46,20.62 U57.1
LCD-BG-LIGHT-CTRL: length 18
  Top Layer w0.254: FPC1.17 75.41,19.25 68.58,26.08 65.28,26.08 U1.36
LCD-CS: length 17.1
  Top Layer w0.254: FPC1.19 74.88,18.25 68.07,25.06 65.68,25.06 64.91,24.29
LCD-DC: length 16.7
  Top Layer w0.254: U1.33 65.88,24.55 67.82,24.55 74.62,17.75 FPC1.20
LCD-SCL: length 17.5
  Top Layer w0.254: FPC1.18 75.15,18.75 68.33,25.57 65.48,25.57 U1.35
LCD-SDA: length 18.4
  Top Layer w0.254: FPC1.16 75.67,19.75 68.83,26.58 65.09,26.58 63.85,25.35
LED-1: length 31.5
  Top Layer w0.254: FPC1.1 72.87,27.25 67.79,32.33 v1(67.79,32.52)
  Bottom Layer w0.254: U53.14 52.54,36.79 53.47,35.86 64.26,35.86 66.93,33.19 67.18,33.19 67.79,32.59 v1(67.79,32.52)
LED-2: length 32.2
  Top Layer w0.254: FPC1.2 72.61,26.75 v1(66.8,32.55)
  Bottom Layer w0.254: v1(66.8,32.55) 64.01,35.35 53.21,35.35 51.89,36.67 U53.15
LED-3: length 33.3
  Top Layer w0.254: v1(66.8,31.54) 67.06,31.54 72.34,26.25 FPC1.3
  Bottom Layer w0.254: v1(66.8,31.54) 66.04,32.3 66.04,32.55 63.75,34.84 52.96,34.84 51.24,36.56 51.24,37.81
MASTER-RX: length 19.3
  Top Layer w0.254: v1(60.96,19.47) 60.96,19.05 U1.23
  Inner2 w0.254: v1(60.96,19.47) 59.31,19.47 58.04,20.74 56.51,20.74 51.56,25.7 51.56,26.46 51.04,26.98 50.18,26.98 49.78,26.58 v1(49.78,26.2)
  Bottom Layer w0.254: U52.3 49.66,27.6 49.78,27.47 v1(49.78,26.2)
MASTER-TX: length 16.8
  Top Layer w0.254: v1(60.32,18.84) 60.46,18.84 U1.22
  Inner2 w0.254: v1(60.32,18.84) 59.18,18.84 57.78,20.23 56.26,20.23 50.8,25.7 v1(50.8,26.2)
  Bottom Layer w0.254: v1(50.8,26.2) 50.8,27.6 50.93,27.73 U52.2
OUTPUT-CTRL: length 78.9
  Top Layer w0.254: v1(57.02,18.71) 56.5,18.71 55.37,17.57
  Inner2 w0.254: v1(57.02,18.71) 53.72,18.71 52.32,20.11 43.31,20.11 36.83,13.63 16,13.63 14.73,14.9 14.73,17.95 15.88,19.09 15.88,27.47 14.99,28.36 12.32,28.36 8.38,24.43 v1(2.41,24.43)
  Bottom Layer w0.254: v1(2.41,24.43) 3.54,24.43 Q2.1 3.55,25.4 R85.2
P_DC_IN: length 83
  Bottom Layer w0.254: DC1.4 15,32.06 11.68,28.74 11.68,15.54 14.22,13 45.21,13 50.55,7.66 50.55,5.38 51.94,3.98 64.64,3.98 65.41,4.74 65.41,6.01 64.9,6.52 R57.2
  vias: v1(25.15,44.11) v1(25.91,44.11) v1(26.67,44.11) v1(27.43,44.11)
P_PD_IN: length 85.1
  Bottom Layer w0.254: 52.8,4.72 52.09,4.72 51.05,5.76 51.05,7.92 45.47,13.5 14.48,13.5 12.19,15.79 12.19,28.49 15.49,31.79 20.45,31.79 22.35,33.7 22.35,37.63 25.02,40.3 27.26,40.3 D34.1
  vias: v1(28.83,44.11) v1(29.59,44.11) v1(30.35,44.11) v1(31.12,44.11)
RESET: length 5.9
  Top Layer w0.254: 53.95,18.99 53.09,18.12 53.09,17.69 53.85,16.93 53.85,15.79 52.71,14.65 v1(52.32,14.65)
SERIAL-LED: length 21.5
  Top Layer w0.254: U1.30 63.45,21.5 v1(63.25,21.5) ; FPC1.6 74.37,24.75 73.7,24.08 v1(73.7,22.61)
  Inner2 w0.254: v1(73.7,22.61) 73.7,21.42 72.39,20.11 64.64,20.11 v1(63.25,21.5)
SLAVE-RX: length 4.3
  Bottom Layer w0.254: U52.7 50.93,35.6 50.59,35.94 U53.17
SLAVE-TX: length 4.3
  Bottom Layer w0.254: U52.6 49.66,35.6 49.94,35.88 U53.18
SWCLK: length 11.5
  Top Layer w0.254: U1.50 54.82,30.84 U50.2
SWDIO: length 11.3
  Top Layer w0.254: U1.49 55.37,31 55.37,38.4 55.82,38.85 U50.1
TEMP-SENSOR-SCL: length 55.7
  Top Layer w0.254: 65.35,28.69 v1(64.98,28.31) 64.69,28.31 U1.40
  Inner2 w0.254: v1(64.98,28.31) 64.72,28.31 64.47,28.06 63.96,28.06 62.36,26.46 57.53,26.46 55.12,28.87 48.77,28.87 43.56,23.66 28.7,23.66 26.92,21.89 19.57,21.89 v1(18.8,22.65)
  Bottom Layer w0.254: v1(18.8,22.65) 18.82,22.65 U60.1
TEMP-SENSOR-SDA: length 57.4
  Top Layer w0.254: 64.59,29.45 64.59,29.38 v1(64.22,29) 64.22,28.54 U1.41
  Inner2 w0.254: v1(17.91,22.65) 17.91,22.78 18.54,23.41 19.05,23.41 20.07,22.39 26.67,22.39 28.45,24.17 43.18,24.17 48.39,29.38 55.37,29.38 57.78,26.97 62.18,26.97 v1(64.22,29)
  Bottom Layer w0.254: U60.6 18.66,21.9 v1(17.91,22.65)
USB-1-CC1: length 2.5
  Top Layer w0.254: USB5.A5 66.12,40.04
  Bottom Layer w0.254: R74.2 66.42,40.34 v1(66.15,40.07)
USB-1-CC2: length 2.7
  Top Layer w0.254: USB5.B5 63.12,39.2 63.61,39.69 v1(63.61,40.07)
  Bottom Layer w0.254: R73.2 63.37,40.3 v1(63.61,40.07)
USB-1-DN: length 19.5
  Top Layer w0.254: USB5.B7 65.62,39.45 65.41,39.67 ; 65.41,39.67 65.41,40.05 v1(65.39,40.07) ; 65.41,39.67 64.9,39.67 64.62,39.39 USB5.A7
  Bottom Layer w0.254: D27.2 65.41,40.08 v1(65.39,40.07) 65.15,39.83 65.15,38.02 63.75,36.62 59.69,36.62 59,37.3 59,38.45 58.55,38.9 54.74,38.9 54.48,38.65
USB-1-DP: length 21.4
  Top Layer w0.254: USB5.A6 65.12,37.61 64.9,37.38 64.39,37.38 64.12,37.64 USB5.B6 64.12,39.57 64.38,39.82
  Bottom Layer w0.254: D28.2 64.39,40.07 v1(64.38,40.06) 64.64,39.8 64.64,38.14 63.47,36.97 59.96,36.97 59.36,37.58 59.36,38.73 58.8,39.28 54.36,39.28 53.84,38.77 53.84,37.81
USB-2-CC1: length 41.8
  Top Layer w0.254: v1(41.15,40.05) 41.12,40.02 USB6.A5 ; U1.43 59.07,24.81 56.9,24.81 56.13,24.05 55.26,24.05 53.6,25.7 51.03,28.27 v1(51.03,30.11)
  Inner2 w0.254: v1(51.03,30.11) 51.03,30.55 49.15,32.43 42.54,32.43 37.85,37.13 37.85,40.3 38.35,40.81 40.64,40.81 41.15,40.3 v1(41.15,40.05)
  Bottom Layer w0.254: D22.2 41.4,40.3 v1(41.15,40.05)
USB-2-CC2: length 35.4
  Top Layer w0.254: U1.44 58.87,25.31 55.4,25.31 U1.57 51.69,29.03 v1(51.69,30.65) ; USB6.B5 38.12,39.18 38.61,39.66 v1(38.61,40.05)
  Inner2 w0.254: v1(51.69,30.65) 49.4,32.94 42.8,32.94 38.61,37.13 v1(38.61,40.05)
  Bottom Layer w0.254: v1(38.61,40.05) 38.35,40.3 D21.2
USB-2-DN: length 36.5
  Top Layer w0.254: U1.45 61.97,29.12 v1(62.23,29.12) ; USB6.A7 39.62,39.41 39.88,39.67 40.39,39.67 40.62,39.43 USB6.B7
  Inner2 w0.254: v1(62.23,29.12) 62.23,29.48 62.87,30.12 62.87,31.67 60.58,33.95 43.31,33.95 40.11,37.15 40.11,39.77 v1(40.39,40.05)
  Bottom Layer w0.254: D24.2 v1(40.39,40.05)
USB-2-DP: length 37.5
  Top Layer w0.254: v1(39.38,40.04) 39.38,39.8 39.12,39.55 USB6.B6 39.12,37.75 39.44,37.43 39.8,37.43 40.13,37.76 40.13,38.48 USB6.A6 ; U1.46 61.64,29.5 v1(61.64,29.72)
  Inner2 w0.254: v1(39.38,40.04) 39.75,39.67 39.75,37 43.18,33.57 60.45,33.57 62.48,31.54 62.48,30.27 61.94,29.72 v1(61.64,29.72)
  Bottom Layer w0.254: D23.2 39.37,40.05 v1(39.38,40.04)
V-DC-SAMPLE: length 3.9
  Bottom Layer w0.254: U62.12 62.83,6.89 R57.1 R68.2 63.19,4.72 D38.2
V-DC-SAMPLE-BUFFERED: length 13.5
  Top Layer w0.254: 59.96,15.8 60.58,15.19 v1(60.58,14.14)
  Bottom Layer w0.254: v1(60.58,14.14) 60.58,12.36 59.69,11.47 59.69,8.68 60.07,8.3 60.07,6.23 ; 60.07,6.23 60.07,5.76 60.24,5.58 U62.14 ; 60.07,6.23 U62.13
V-IN-SAMPLE: length 4.2
  Bottom Layer w0.254: 53.56,10.44 53.66,10.33 53.66,8.53 54.01,8.19 U62.5
V-IN-SAMPLE-BUFFERED: length 13.1
  Top Layer w0.254: v1(54.48,16.17) 54.67,16.17 55.72,17.22
  Bottom Layer w0.254: U62.6 56.84,8.83 57.02,9.01 57.02,9.48 ; U62.7 57.02,9.48 ; 57.02,9.48 57.02,11.47 53.85,14.65 53.85,15.66 54.36,16.17 v1(54.48,16.17)
V-OUT-SAMPLE: length 4
  Bottom Layer w0.254: R55.1 R66.2 63.19,8.53 D36.2 63.06,8.19 U62.10
V-OUT-SAMPLE-BUFFERED: length 11.4
  Top Layer w0.254: v1(62.23,14.9) 62.23,14.95 U1.19
  Bottom Layer w0.254: 60.2,9.49 60.2,8.93 60.29,8.83 U62.9 ; 60.2,9.49 60.2,11.22 62.23,13.25 v1(62.23,14.9) ; 60.2,9.49 61.34,9.49 U62.8
V-PD-SAMPLE: length 4.2
  Bottom Layer w0.254: 53.66,4.72 53.66,6.52 53.56,6.63 53.81,6.89 U62.3
V-PD-SAMPLE-BUFFERED: length 15
  Top Layer w0.254: U1.14 55.63,15.71 v1(55.63,14.52)
  Bottom Layer w0.254: v1(55.63,14.52) 55.63,14.29 57.91,12 57.91,7.12 57.02,6.23 ; U62.1 55.75,5.58 56.84,5.58 57.02,5.76 57.02,6.23 ; U62.2 57.02,6.23
VOUT: length 36.6
  Bottom Layer w0.254: v1(42.16,11.34) 45.97,11.34 50.04,7.28 50.04,5.25 51.81,3.48 64.91,3.48 65.91,4.49 65.91,9.19 64.77,10.33 R55.2
  Bottom Layer w0.508: v1(17.81,16.57) 17.81,17.51 U57.4
  vias: v1(15.88,7.28) v1(16.51,7.28) v1(17.14,7.28) v1(18.41,7.28) v1(19.05,7.28) v1(19.69,7.28) v1(20.96,7.28) v1(21.59,7.28) v1(22.22,7.28) v1(23.5,7.28) v1(24.13,7.28) v1(24.76,7.28) v1(26.03,7.28) v1(26.67,7.28) v1(27.31,7.28) v1(28.57,7.28) v1(29.21,7.28) v1(29.84,7.28) v1(31.12,7.28) v1(31.75,7.28) v1(32.38,7.28) v1(33.66,7.28) v1(34.29,7.28) v1(34.93,7.28) v1(36.19,7.28) v1(36.83,7.28) v1(37.47,7.28)
$1N8031: length 2.5
  Bottom Layer w0.508: R17.1 U9.7
$1N8032: length 2.5
  Bottom Layer w0.508: R18.1 U9.5
$1N8033: length 5.7
  Bottom Layer w0.508: D5.1 31.72,26.81 31.37,26.46 U9.8 27.75,26.46
$1N8039: length 2.5
  Bottom Layer w0.508: R20.2 U10.5
$1N8040: length 2.5
  Bottom Layer w0.508: R19.2 U10.7
$1N8048: length 5.7
  Bottom Layer w0.254: R21.2 27.05,16.8 27.05,17.88 C15.2
  Bottom Layer w0.508: R21.2 U10.6
$1N8049: length 5.7
  Bottom Layer w0.254: C14.2 27.05,25.76 27.05,24.67 R22.1
  Bottom Layer w0.508: R22.1 U9.6
$1N8055: length 6.3
  Top Layer w0.508: U48.2 21.97,24.93 22.35,25.31 v1(22.35,25.57)
  Bottom Layer w0.508: R17.2 25.4,25.19 24.26,26.33 23,26.33 22.35,25.69 v1(22.35,25.57)
$1N8056: length 3
  Top Layer w0.508: U48.4 24.76,24.02 v1(24.76,23.16)
  Bottom Layer w0.508: R18.2 25.27,22.65 v1(24.76,23.16)
$1N8057: length 2.8
  Top Layer w0.508: U49.4 24.76,15.64 v1(24.76,14.77)
  Bottom Layer w0.508: v1(24.76,14.77) R20.1
$1N8058: length 6
  Top Layer w0.508: U49.2 21.97,16.55 22.35,16.93 v1(22.35,17.19)
  Bottom Layer w0.508: R19.1 24.75,17.31 24.17,17.9 22.95,17.9 22.35,17.3 v1(22.35,17.19)
$1N8059: length 0.8
  Bottom Layer w0.508: U57.3 17.78,20.19 v1(17.78,20.87)
  vias: v1(19.44,19.99)
$1N8062: length 0.6
  Bottom Layer w0.508: v1(25.65,23.92) R22.2
  vias: v1(19.43,25.57) v1(19.43,24.93) v1(20.07,25.57) v1(20.07,24.93) v1(20.7,25.59) v1(20.7,24.93) v1(21.34,25.57) v1(23.24,29) v1(23.24,28.36) v1(23.24,27.73) v1(23.24,27.09) v1(23.88,29) v1(23.88,28.36) v1(23.88,27.73) v1(23.88,27.09) v1(24.51,29) v1(24.51,28.36) v1(24.51,27.73) v1(24.51,27.09)
$1N8063: length 0.9
  Bottom Layer w0.508: R21.1 v1(25.4,16.04)
  vias: v1(19.43,17.19) v1(19.43,16.55) v1(20.07,17.19) v1(20.07,16.55) v1(20.7,17.21) v1(20.7,16.55) v1(21.34,17.19) v1(23.24,20.62) v1(23.24,19.98) v1(23.24,19.35) v1(23.24,18.71) v1(23.88,20.62) v1(23.88,19.98) v1(23.88,19.35) v1(23.88,18.71) v1(24.51,20.62) v1(24.51,19.98) v1(24.51,19.35) v1(24.51,18.71)
$1N8076: length 1
  Bottom Layer w0.508: U56.4 17.8,25.75 v1(17.8,24.83)
  vias: v1(19.44,28.36)
$1N8100: length 5.6
  Bottom Layer w0.508: 27.75,18.58 U10.8 31.24,18.58 31.72,19.06 D6.1
$1N12416: length 6
  Top Layer w0.254: 48.77,16.46 50.32,16.46 51.31,17.44 51.31,17.76 U1.5
$1N12417: length 4
  Top Layer w0.254: U1.6 51.82,17.56 51.82,16.39 51.56,16.14
$1N15013: length 9
  Bottom Layer w0.254: C79.1 29.92,29.71 31.04,30.83 L2.1
  Bottom Layer w0.508: L2.1 29.27,33.69 U58.6 29.52,34.97 D31.1
$1N15041: length 1.4
  Bottom Layer w0.254: C79.2 29.34,31.85 U58.1
$1N15176: length 2.3
  Bottom Layer w0.254: U58.3 27.51,31.78 R76.2 R75.1
$1N15271: length 1.3
  Bottom Layer w0.254: R77.1 27.37,35.97 U58.4
$1N15727: length 8.9
  Bottom Layer w0.254: L3.1 40.84,29.7 39.59,30.94 C82.1
  Bottom Layer w0.508: L3.1 43.57,31.47 44.6,31.47 44.85,31.22 D32.1
$1N15730: length 1.4
  Bottom Layer w0.254: 41.8,31.47 41.73,31.4 C82.2
$1N15737: length 2.3
  Bottom Layer w0.254: R78.1 39.53,33.37 U59.3
$1N15756: length 1.3
  Bottom Layer w0.254: U59.4 45.86,33.37 R80.1
$1N22283: length 6.4
  Bottom Layer w0.254: U53.13 53.19,36.9 53.72,36.36 57.15,36.36 57.91,37.13 57.91,37.38

## Copper pours and planes (outline as drawn; the poured copper is in the pictures)
GND on Top Layer: 0,42 0.01,42.26 0.06,42.61 0.15,42.94 0.28,43.27 0.45,43.57 0.65,43.86 0.88,44.12 1.14,44.35 1.43,44.55 1.73,44.72 2.06,44.85 2.39,44.94 2.74,44.99 3,45 77,45 77.26,44.99 77.61,44.94 77.94,44.85 78.27,44.72 78.57,44.55 78.86,44.35 79.12,44.12 79.35,43.86 79.55,43.57 79.72,43.27 79.85,42.94 79.94,42.61 79.99,42.26 80,42 80,3 79.99,2.74 79.94,2.39 79.85,2.06 79.72,1.73 79.55,1.43 79.35,1.14 79.12,0.88 78.86,0.65 78.57,0.45 78.27,0.28 77.94,0.15 77.61,0.06 77.26,0.01 77,0 3,0 2.74,0.01 2.39,0.06 2.06,0.15 1.73,0.28 1.43,0.45 1.14,0.65 0.88,0.88 0.65,1.14 0.45,1.43 0.28,1.73 0.15,2.06 0.06,2.39 0.01,2.74 0,3
GND on Top Layer: 22.1,17.44 24.38,17.44 24.38,14.39 22.1,14.39
GND on Top Layer: 22.1,25.82 24.38,25.82 24.38,22.78 22.1,22.78
GND on Bottom Layer: 0,42 0.01,42.26 0.06,42.61 0.15,42.94 0.28,43.27 0.45,43.57 0.65,43.86 0.88,44.12 1.14,44.35 1.43,44.55 1.73,44.72 2.06,44.85 2.39,44.94 2.74,44.99 3,45 77,45 77.26,44.99 77.61,44.94 77.94,44.85 78.27,44.72 78.57,44.55 78.86,44.35 79.12,44.12 79.35,43.86 79.55,43.57 79.72,43.27 79.85,42.94 79.94,42.61 79.99,42.26 80,42 80,3 79.99,2.74 79.94,2.39 79.85,2.06 79.72,1.73 79.55,1.43 79.35,1.14 79.12,0.88 78.86,0.65 78.57,0.45 78.27,0.28 77.94,0.15 77.61,0.06 77.26,0.01 77,0 3,0 2.74,0.01 2.39,0.06 2.06,0.15 1.73,0.28 1.43,0.45 1.14,0.65 0.88,0.88 0.65,1.14 0.45,1.43 0.28,1.73 0.15,2.06 0.06,2.39 0.01,2.74 0,3
GND on Inner1: 0,42 0.01,42.26 0.06,42.61 0.15,42.94 0.28,43.27 0.45,43.57 0.65,43.86 0.88,44.12 1.14,44.35 1.43,44.55 1.73,44.72 2.06,44.85 2.39,44.94 2.74,44.99 3,45 77,45 77.26,44.99 77.61,44.94 77.94,44.85 78.27,44.72 78.57,44.55 78.86,44.35 79.12,44.12 79.35,43.86 79.55,43.57 79.72,43.27 79.85,42.94 79.94,42.61 79.99,42.26 80,42 80,3 79.99,2.74 79.94,2.39 79.85,2.06 79.72,1.73 79.55,1.43 79.35,1.14 79.12,0.88 78.86,0.65 78.57,0.45 78.27,0.28 77.94,0.15 77.61,0.06 77.26,0.01 77,0 3,0 2.74,0.01 2.39,0.06 2.06,0.15 1.73,0.28 1.43,0.45 1.14,0.65 0.88,0.88 0.65,1.14 0.45,1.43 0.28,1.73 0.15,2.06 0.06,2.39 0.01,2.74 0,3
GND on Inner2: 0,42 0.01,42.26 0.06,42.61 0.15,42.94 0.28,43.27 0.45,43.57 0.65,43.86 0.88,44.12 1.14,44.35 1.43,44.55 1.73,44.72 2.06,44.85 2.39,44.94 2.74,44.99 3,45 77,45 77.26,44.99 77.61,44.94 77.94,44.85 78.27,44.72 78.57,44.55 78.86,44.35 79.12,44.12 79.35,43.86 79.55,43.57 79.72,43.27 79.85,42.94 79.94,42.61 79.99,42.26 80,42 80,3 79.99,2.74 79.94,2.39 79.85,2.06 79.72,1.73 79.55,1.43 79.35,1.14 79.12,0.88 78.86,0.65 78.57,0.45 78.27,0.28 77.94,0.15 77.61,0.06 77.26,0.01 77,0 3,0 2.74,0.01 2.39,0.06 2.06,0.15 1.73,0.28 1.43,0.45 1.14,0.65 0.88,0.88 0.65,1.14 0.45,1.43 0.28,1.73 0.15,2.06 0.06,2.39 0.01,2.74 0,3
VIN on Top Layer: 23.11,41.7 32.77,41.7 32.77,34.84 25.27,34.84 25.27,32.56 23.74,31.03 20.07,31.03 19.18,30.12 19.18,29.39 18.02,28.24 4.57,28.24 4.57,34.46 8.25,34.46 10.41,32.3 16.26,32.3 23.11,39.16
VIN on Bottom Layer: 0.25,34.46 8.51,34.46 8.51,32.3 11.05,32.3 11.05,29.63 0.25,29.63
P_DC_IN on Top Layer: 13.33,32.55 16.13,32.55 22.86,39.28 22.86,41.95 27.94,41.95 27.94,44.75 13.33,44.75
P_DC_IN on Bottom Layer: 24.64,44.75 27.94,44.75 27.94,41.95 24.64,41.95
P_PD_IN on Top Layer: 28.32,44.75 28.32,41.95 33.02,41.95 33.02,35.6 42.67,35.6 42.67,44.75
P_PD_IN on Bottom Layer: 28.32,44.75 31.62,44.75 31.62,41.95 28.32,41.95
VOUT on Top Layer: 15.11,19.22 17.27,19.22 18.8,17.69 18.8,14.39 42.67,14.39 42.67,6.27 14.35,6.27 8.89,11.73 8.89,14.27 10.67,16.04 11.94,16.04
VOUT on Bottom Layer: 15.24,9.57 38.23,9.57 38.23,4.87 15.24,4.87
$1N8059 on Top Layer: 15.11,22.52 22.48,22.52 22.48,17.82 19.05,17.82 17.4,19.47 15.11,19.47
$1N8062 on Top Layer: 19.05,22.78 19.05,25.95 22.73,25.95 22.73,30.78 23.88,30.78 25.53,32.43 25.53,34.59 42.67,34.59 42.67,25.19 27.81,25.19 25.4,22.78
$1N8062 on Bottom Layer: 25.15,29.63 25.15,26.46 23.57,26.46 21.59,24.68 21.34,24.43 18.92,24.43 18.92,27.09 21.46,29.63
$1N8063 on Top Layer: 19.05,14.39 19.05,17.57 22.73,17.57 22.73,22.52 25.65,22.52 27.94,24.81 42.67,24.81 42.67,14.39
$1N8063 on Bottom Layer: 25.15,21.25 25.15,18.08 23.57,18.08 21.59,16.3 21.34,16.04 18.92,16.04 18.92,18.71 21.46,21.25
$1N8076 on Top Layer: 19.43,30.03 20.16,30.78 22.48,30.78 22.48,26.2 18.8,26.2 18.8,22.78 15.11,22.78 15.11,27.98 18.03,27.98 19.43,29.38
$1N11837 on Bottom Layer: 0.38,23.79 4.44,23.79 4.44,19.73 11.18,19.73 11.18,6.65 0.38,6.65

Small or netless copper shapes (teardrops, artwork), in the pictures only: 104 on Top Layer, 273 on Bottom Layer, 30 on Inner2

## Text on the board
Bottom Silkscreen Layer: DC IN | 12-30V | LINK / PD | LINK | MASTER RST | SLAVE ISP | 0-32V | DC OUT | EXT BOARD
Top Layer: Digital Power | Hardware Ver 1.1
Top Solder Mask Layer: Digital Power | Hardware Ver 1.1
